# Altium schematic sheet ZB3.SchDoc
size A3; SheetNumber: 3; SheetTotal: 3
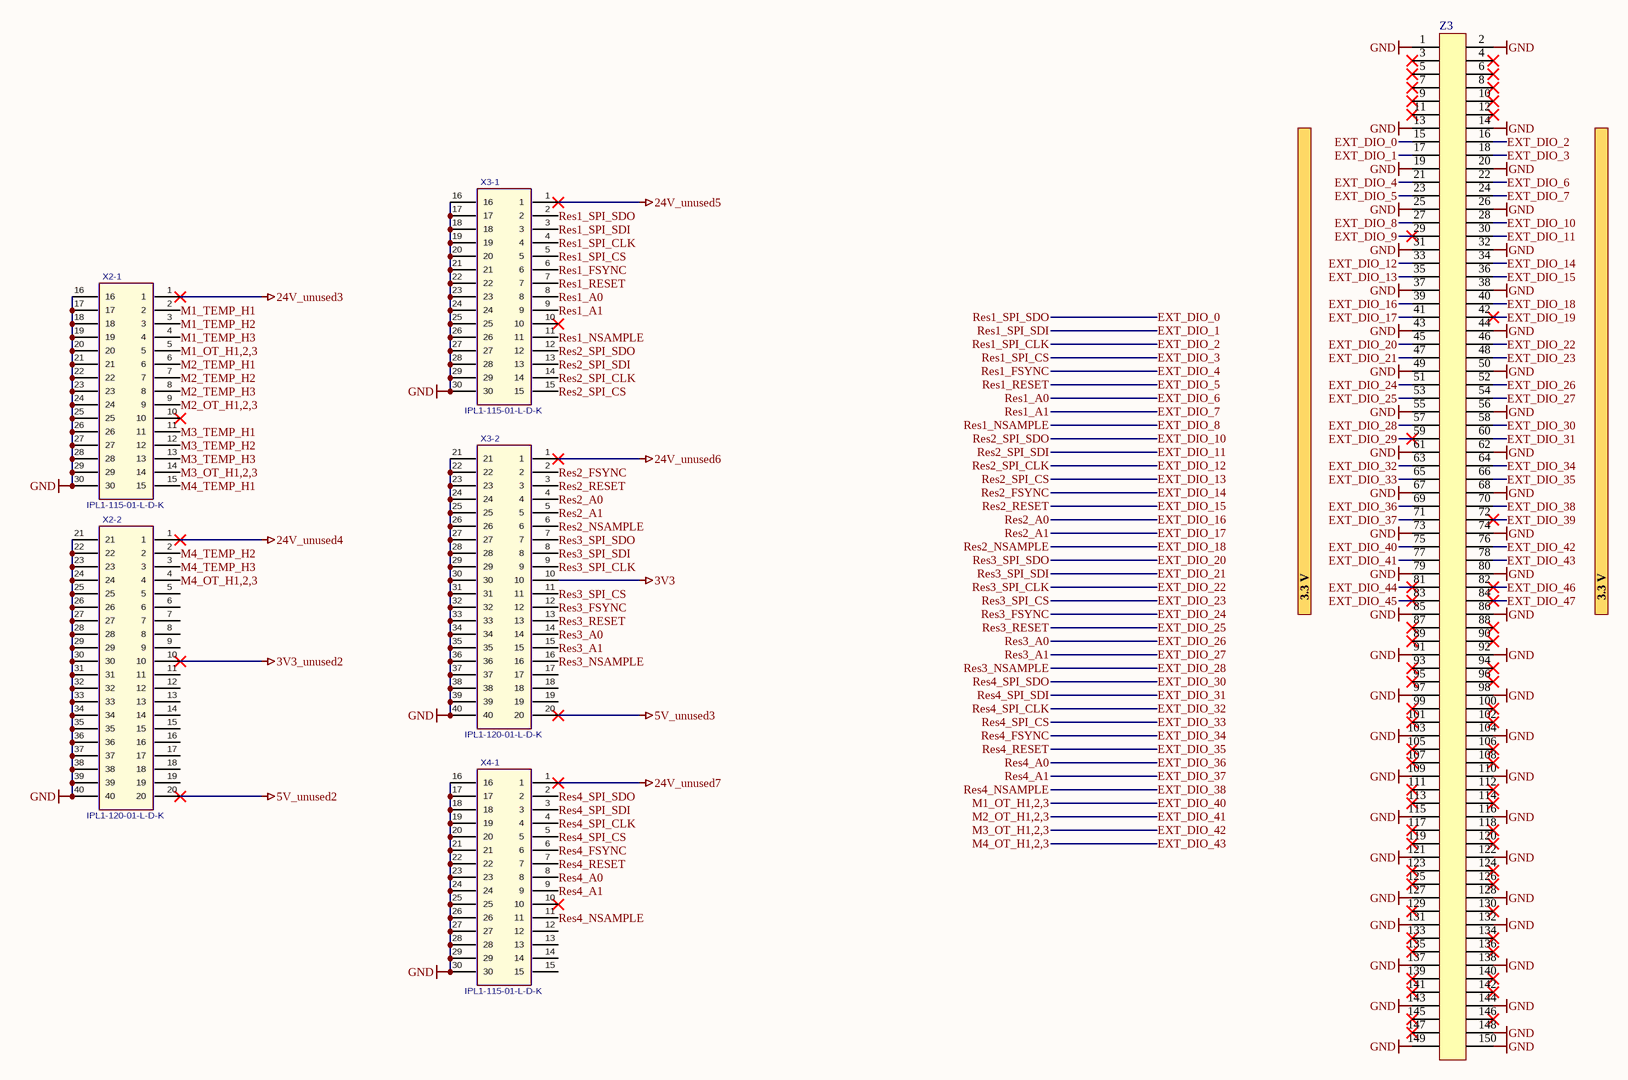
[diagram p0: ZB3.SchDoc]

## Parts
X2-1  IPL1-115-01-L-D-K  [IPL1-115-01-YYY-D-K]
X2-2  IPL1-120-01-L-D-K  [SAMTEC_IPL1-120-01-X-D-K]
X3-1  IPL1-115-01-L-D-K  [IPL1-115-01-YYY-D-K]
X3-2  IPL1-120-01-L-D-K  [SAMTEC_IPL1-120-01-X-D-K]
X4-1  IPL1-115-01-L-D-K  [IPL1-115-01-YYY-D-K]
Z3  (no value)  [ERM8-075-02.0-L-DV]

## Nets
3V3: X3-2.10
3V3_unused2: X2-2.10
5V_unused2: X2-2.20
5V_unused3: X3-2.20
24V_unused3: X2-1.1
24V_unused4: X2-2.1
24V_unused5: X3-1.1
24V_unused6: X3-2.1
24V_unused7: X4-1.1
GND: X2-1.16 X2-1.17 X2-1.18 X2-1.19 X2-1.20 X2-1.21 X2-1.22 X2-1.23 X2-1.24 X2-1.25 X2-1.26 X2-1.27 X2-1.28 X2-1.29 X2-1.30 X2-2.21 X2-2.22 X2-2.23 X2-2.24 X2-2.25 X2-2.26 X2-2.27 X2-2.28 X2-2.29 X2-2.30 X2-2.31 X2-2.32 X2-2.33 X2-2.34 X2-2.35 X2-2.36 X2-2.37 X2-2.38 X2-2.39 X2-2.40 X3-1.16 X3-1.17 X3-1.18 X3-1.19 X3-1.20 X3-1.21 X3-1.22 X3-1.23 X3-1.24 X3-1.25 X3-1.26 X3-1.27 X3-1.28 X3-1.29 X3-1.30 X3-2.21 X3-2.22 X3-2.23 X3-2.24 X3-2.25 X3-2.26 X3-2.27 X3-2.28 X3-2.29 X3-2.30 X3-2.31 X3-2.32 X3-2.33 X3-2.34 X3-2.35 X3-2.36 X3-2.37 X3-2.38 X3-2.39 X3-2.40 X4-1.16 X4-1.17 X4-1.18 X4-1.19 X4-1.20 X4-1.21 X4-1.22 X4-1.23 X4-1.24 X4-1.25 X4-1.26 X4-1.27 X4-1.28 X4-1.29 X4-1.30 Z3.1 Z3.2 Z3.13 Z3.14 Z3.19 Z3.20 Z3.25 Z3.26 Z3.31 Z3.32 Z3.37 Z3.38 Z3.43 Z3.44 Z3.49 Z3.50 Z3.55 Z3.56 Z3.61 Z3.62 Z3.67 Z3.68 Z3.73 Z3.74 Z3.79 Z3.80 Z3.85 Z3.86 Z3.91 Z3.92 Z3.97 Z3.98 Z3.103 Z3.104 Z3.109 Z3.110 Z3.115 Z3.116 Z3.121 Z3.122 Z3.127 Z3.128 Z3.131 Z3.132 Z3.137 Z3.138 Z3.143 Z3.144 Z3.148 Z3.149 Z3.150
EXT_DIO_0: X3-1.2 Z3.15  [also labelled Res1_SPI_SDO]
EXT_DIO_1: X3-1.3 Z3.17  [also labelled Res1_SPI_SDI]
EXT_DIO_2: X3-1.4 Z3.16  [also labelled Res1_SPI_CLK]
EXT_DIO_3: X3-1.5 Z3.18  [also labelled Res1_SPI_CS]
EXT_DIO_4: X3-1.6 Z3.21  [also labelled Res1_FSYNC]
EXT_DIO_5: X3-1.7 Z3.23  [also labelled Res1_RESET]
EXT_DIO_6: X3-1.8 Z3.22  [also labelled Res1_A0]
EXT_DIO_7: X3-1.9 Z3.24  [also labelled Res1_A1]
EXT_DIO_8: X3-1.11 Z3.27  [also labelled Res1_NSAMPLE]
EXT_DIO_9: Z3.29
EXT_DIO_10: X3-1.12 Z3.28  [also labelled Res2_SPI_SDO]
EXT_DIO_11: X3-1.13 Z3.30  [also labelled Res2_SPI_SDI]
EXT_DIO_12: X3-1.14 Z3.33  [also labelled Res2_SPI_CLK]
EXT_DIO_13: X3-1.15 Z3.35  [also labelled Res2_SPI_CS]
EXT_DIO_14: X3-2.2 Z3.34  [also labelled Res2_FSYNC]
EXT_DIO_15: X3-2.3 Z3.36  [also labelled Res2_RESET]
EXT_DIO_16: X3-2.4 Z3.39  [also labelled Res2_A0]
EXT_DIO_17: X3-2.5 Z3.41  [also labelled Res2_A1]
EXT_DIO_18: X3-2.6 Z3.40  [also labelled Res2_NSAMPLE]
EXT_DIO_19: Z3.42
EXT_DIO_20: X3-2.7 Z3.45  [also labelled Res3_SPI_SDO]
EXT_DIO_21: X3-2.8 Z3.47  [also labelled Res3_SPI_SDI]
EXT_DIO_22: X3-2.9 Z3.46  [also labelled Res3_SPI_CLK]
EXT_DIO_23: X3-2.11 Z3.48  [also labelled Res3_SPI_CS]
EXT_DIO_24: X3-2.12 Z3.51  [also labelled Res3_FSYNC]
EXT_DIO_25: X3-2.13 Z3.53  [also labelled Res3_RESET]
EXT_DIO_26: X3-2.14 Z3.52  [also labelled Res3_A0]
EXT_DIO_27: X3-2.15 Z3.54  [also labelled Res3_A1]
EXT_DIO_28: X3-2.16 Z3.57  [also labelled Res3_NSAMPLE]
EXT_DIO_29: Z3.59
EXT_DIO_30: X4-1.2 Z3.58  [also labelled Res4_SPI_SDO]
EXT_DIO_31: X4-1.3 Z3.60  [also labelled Res4_SPI_SDI]
EXT_DIO_32: X4-1.4 Z3.63  [also labelled Res4_SPI_CLK]
EXT_DIO_33: X4-1.5 Z3.65  [also labelled Res4_SPI_CS]
EXT_DIO_34: X4-1.6 Z3.64  [also labelled Res4_FSYNC]
EXT_DIO_35: X4-1.7 Z3.66  [also labelled Res4_RESET]
EXT_DIO_36: X4-1.8 Z3.69  [also labelled Res4_A0]
EXT_DIO_37: X4-1.9 Z3.71  [also labelled Res4_A1]
EXT_DIO_38: X4-1.11 Z3.70  [also labelled Res4_NSAMPLE]
EXT_DIO_39: Z3.72
EXT_DIO_40: X2-1.5 Z3.75  [also labelled M1_OT_H1,2,3]
EXT_DIO_41: X2-1.9 Z3.77  [also labelled M2_OT_H1,2,3]
EXT_DIO_42: X2-1.14 Z3.76  [also labelled M3_OT_H1,2,3]
EXT_DIO_43: X2-2.4 Z3.78  [also labelled M4_OT_H1,2,3]
EXT_DIO_44: Z3.81
EXT_DIO_45: Z3.83
EXT_DIO_46: Z3.82
EXT_DIO_47: Z3.84
M1_TEMP_H1: X2-1.2
M1_TEMP_H2: X2-1.3
M1_TEMP_H3: X2-1.4
M2_TEMP_H1: X2-1.6
M2_TEMP_H2: X2-1.7
M2_TEMP_H3: X2-1.8
M3_TEMP_H1: X2-1.11
M3_TEMP_H2: X2-1.12
M3_TEMP_H3: X2-1.13
M4_TEMP_H1: X2-1.15
M4_TEMP_H2: X2-2.2
M4_TEMP_H3: X2-2.3

Not connected (* = marked no-connect by the designer): X2-1 10*; X2-2 5 6 7 8 9 11 12 13 14 15 16 17 18 19; X3-1 10*; X3-2 17 18 19; X4-1 10* 12 13 14 15; Z3 3* 4* 5* 6* 7* 8* 9* 10* 11* 12* 87* 88* 89* 90* 93* 94* 95* 96* 99* 100* 101* 102* 105* 106* 107* 108* 111* 112* 113* 114* 117* 118* 119* 120* 123* 124* 125* 126* 129* 130* 133* 134* 135* 136* 139* 140* 141* 142* 145* 146* 147*

## Notes on the sheet
- 3.3 V
- Title
- Revision:
- Design Engineer:
- Date:
- Project:
- Sheet
- of

## Library data of the parts
X2-1 X3-1 X4-1 = IPL1-115-01-L-D-K: 2.54 mm Double Row Terminal Assembly; Manufacturer: SAMTEC; Created from: MGremer; Number of positions: 30; Manufacturer Part Number: IPL1-115-01-L-D-K; PartID: 28; Created On: 01.12.2020 18:14:32; ComponentLink1Description: Homepage; ComponentLink1URL: https://www.samtec.com/de/products/ipl1; Component Type: Samtec Connector; Device Package: Connector; Last Updated: 29.07.2026 10:31:31; Mounting Type: THT; Supplier 1: SAMTEC; Supplier Part Number 1: IPL1-115-01-L-D-K; Type: Connector; Live Cycle Status: 1; Number of rows: 2; Stock number: not stored; LCSC Part Number: C17431809
X2-2 X3-2 = IPL1-120-01-L-D-K: Terminal Assembly, Double Row, Thru-Hole, 2.54 mm x 2.54 mm Pitch, 40 Pins; Manufacturer: SAMTEC; Created from: PBaumann; Number of positions: 40; Manufacturer Part Number: IPL1-120-01-L-D-K; PartID: 42; Created On: 24.03.2021 02:48:34; ComponentLink1Description: Homepage; ComponentLink1URL: https://www.samtec.com/products/ipl1; Component Type: Samtec Connector; Device Package: Connector; Last Updated: 29.07.2026 10:32:29; Mounting Type: THT; Supplier 1: SAMTEC; Supplier Part Number 1: IPL1-120-01-L-D-K; Type: Connector; Live Cycle Status: 1; Number of rows: 2; Stock number: not stored; LCSC Part Number: C17429670
Z3 = ERM8-075-02.0-L-DV-TR: 0.80 mm Edge Rate Rugged High Speed; Manufacturer: SAMTEC; Created from: AGeiger; Manufacturer Part Number: ERM8-075-02.0-L-DV-TR; PartID: 62; Created On: 15.08.2025 09:35:44; ComponentLink1Description: Datasheet; ComponentLink1URL: https://suddendocs.samtec.com/catalog_english/erm8.pdf; Last Updated: 23.09.2025 10:14:21; Mounting Type: SMD; Operating Temperature: -55 °C to +125 °C; Series: ERM8; Supplier 1: LCSC; Supplier Part Number 1: C6845629; Value: ERM8-075-02.0-L-DV-TR; LCSC Part Number: C6845629